# EAGLE schematic RAMBo (EAGLE 6.5.0)
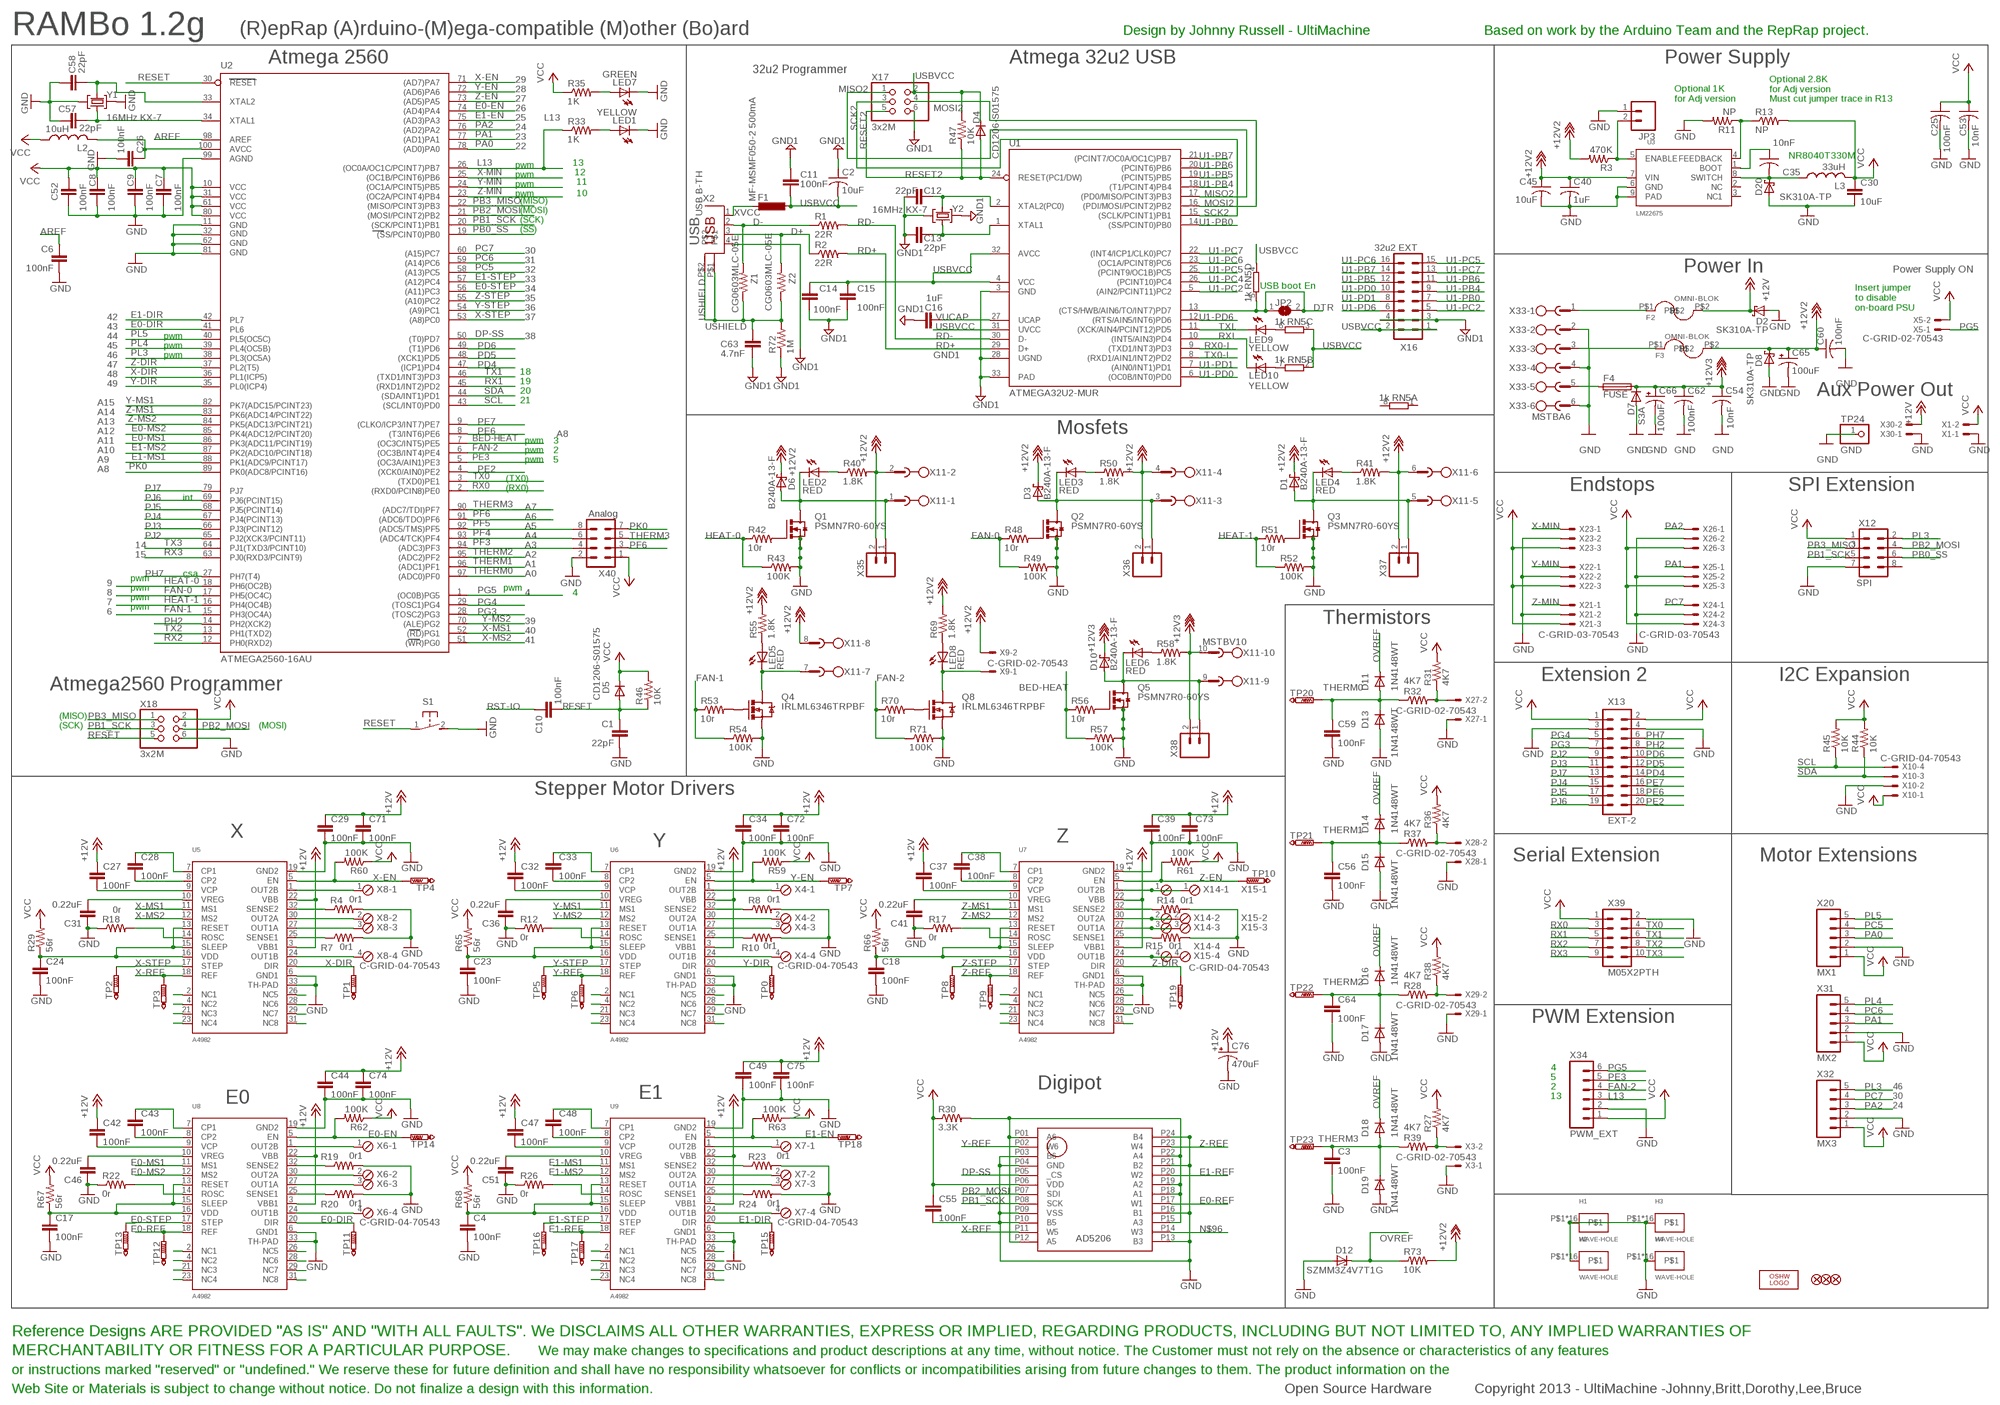
[diagram p0: schematic, sheet 1, part 1 of 2]
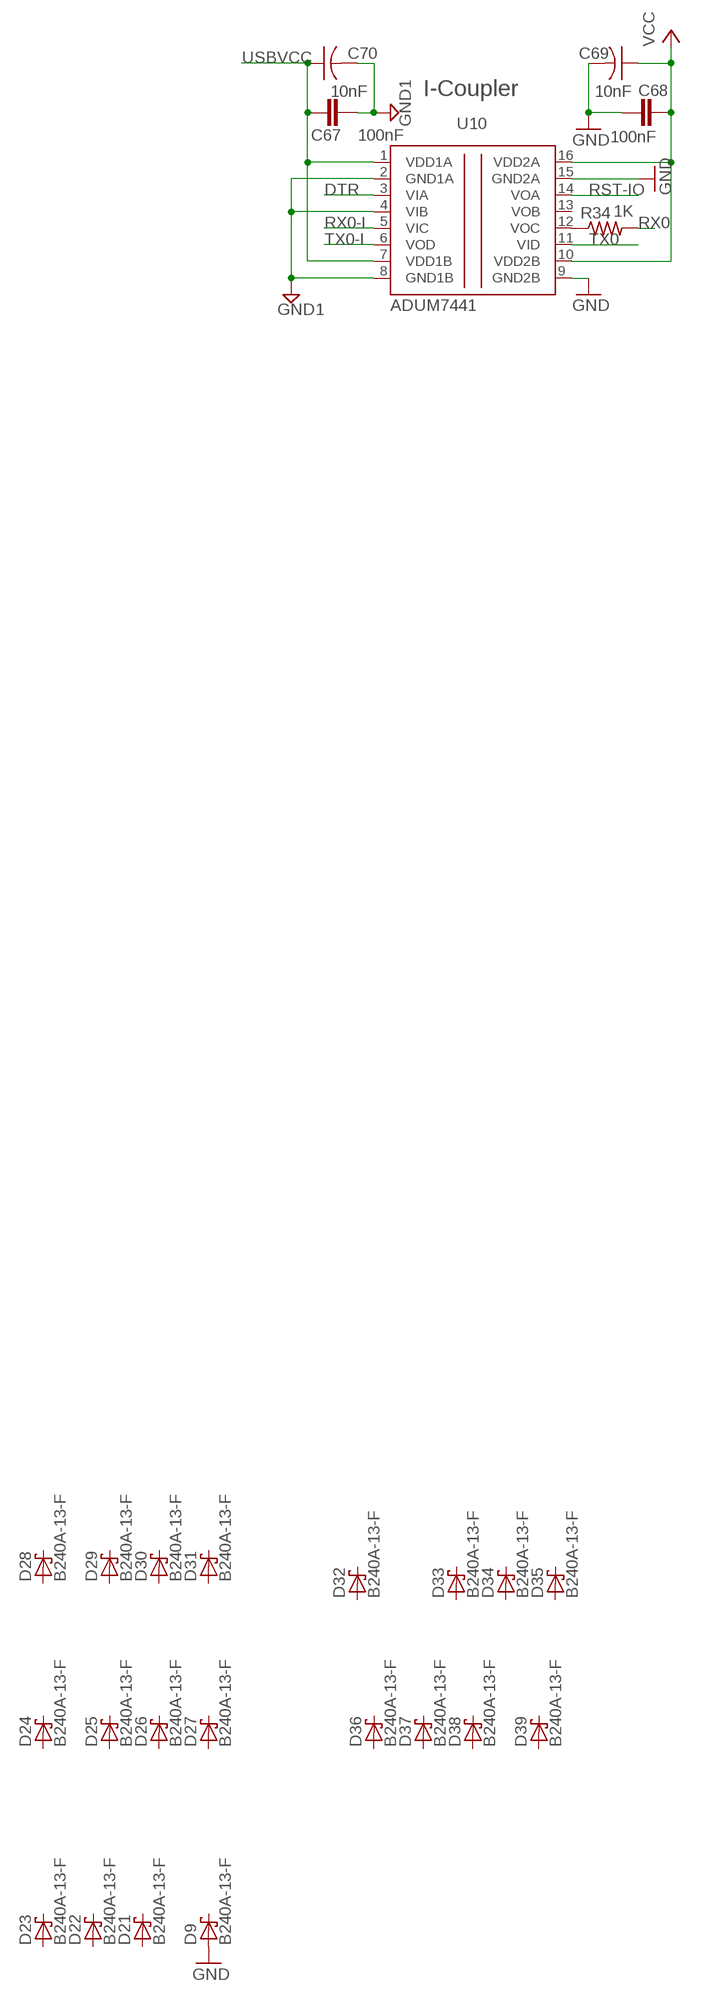
[diagram p1: schematic, sheet 1, part 2 of 2]

## Parts
C1  22pF  C-EUC0603  [C0603]
C2  10uF  C-USC0805  [C0805]
C3  100nF  C-EUC0603  [C0603]
C4  100nF  C-EUC0603  [C0603]
C6  100nF  C-EUC0603  [C0603]
C7  100nF  C-EUC0603  [C0603]
C8  100nF  C-EUC0603  [C0603]
C9  100nF  C-EUC0603  [C0603]
C10  100nF  C-EUC0603  [C0603]
C11  100nF  C-EUC0603  [C0603]
C12  22pF  C-EUC0603  [C0603]
C13  22pF  C-EUC0603  [C0603]
C14  100nF  C-EUC0603  [C0603]
C15  100nF  C-EUC0603  [C0603]
C16  1uF  C-EUC0603  [C0603]
C17  100nF  C-EUC0603  [C0603]
C18  100nF  C-EUC0603  [C0603]
C23  100nF  C-EUC0603  [C0603]
C24  100nF  C-EUC0603  [C0603]
C25  100nF  C-USC0603  [C0603]
C26  100nF  C-EUC0603  [C0603]
C27  100nF  C-EUC0603  [C0603]
C28  100nF  C-EUC0603  [C0603]
C29  100nF  C-EUC0603  [C0603]
C30  10uF  C-EUC1210K  [C1210K]
C31  0.22uF  C-EUC0603  [C0603]
C32  100nF  C-EUC0603  [C0603]
C33  100nF  C-EUC0603  [C0603]
C34  100nF  C-EUC0603  [C0603]
C35  10nF  C-USC0603  [C0603]
C36  0.22uF  C-EUC0603  [C0603]
C37  100nF  C-EUC0603  [C0603]
C38  100nF  C-EUC0603  [C0603]
C39  100nF  C-EUC0603  [C0603]
C40  1uF  C-USC0805  [C0805]
C41  0.22uF  C-EUC0603  [C0603]
C42  100nF  C-EUC0603  [C0603]
C43  100nF  C-EUC0603  [C0603]
C44  100nF  C-EUC0603  [C0603]
C45  10uF  C-USC2220K  [C2220K]
C46  0.22uF  C-EUC0603  [C0603]
C47  100nF  C-EUC0603  [C0603]
C48  100nF  C-EUC0603  [C0603]
C49  100nF  C-EUC0603  [C0603]
C51  0.22uF  C-EUC0603  [C0603]
C52  100nF  C-EUC0603  [C0603]
C53  10nF  C-USC0603  [C0603]
C54  10nF  C-USC0603  [C0603]
C55  100nF  C-EUC0603  [C0603]
C56  100nF  C-EUC0603  [C0603]
C57  22pF  C-EUC0603  [C0603]
C58  22pF  C-EUC0603  [C0603]
C59  100nF  C-EUC0603  [C0603]
C60  100nF  C-USC0603  [C0603]
C62  100nF  C-USC0603  [C0603]
C63  4.7nF  C-EUC0402  [C0402]
C64  100nF  C-EUC0603  [C0603]
C65  100uF  CPOL-USE3.5-8  [E3,5-8]
C66  100uF  CPOL-USE3.5-8  [E3,5-8]
C67  100nF  C-EUC0603  [C0603]
C68  100nF  C-EUC0603  [C0603]
C69  10nF  C-USC0603  [C0603]
C70  10nF  C-USC0603  [C0603]
C71  100nF  C-EUC0603  [C0603]
C72  100nF  C-EUC0603  [C0603]
C73  100nF  C-EUC0603  [C0603]
C74  100nF  C-EUC0603  [C0603]
C75  100nF  C-EUC0603  [C0603]
C76  470uF  CPOL-USC12,5-5  [C12,5-5]
D1  B240A-13-F  SCHOTTKY-DIODE  [SMA-SM]
D2  SK310A-TP  SCHOTTKY-DIODE  [SMA-SM]
D3  B240A-13-F  SCHOTTKY-DIODE  [SMA-SM]
D4  CD1206-S01575  DIODE-MINIMELF  [MINIMELF]
D5  CD1206-S01575  DIODE-MINIMELF  [MINIMELF]
D6  B240A-13-F  SCHOTTKY-DIODE  [SMA-SM]
D7  S3A  DIODE-D0-214AB  [DO-214AB]
D8  SK310A-TP  SCHOTTKY-DIODE  [SMA-SM]
D9  B240A-13-F  SCHOTTKY-DIODE  [SMA-SM]
D10  B240A-13-F  SCHOTTKY-DIODE  [SMA-SM]
D11  1N4148WT  [SOD523]
D12  SZMM3Z4V7T1G  ZENER-DIODESOD323  [SOD323-R]
D13  1N4148WT  [SOD523]
D14  1N4148WT  [SOD523]
D15  1N4148WT  [SOD523]
D16  1N4148WT  [SOD523]
D17  1N4148WT  [SOD523]
D18  1N4148WT  [SOD523]
D19  1N4148WT  [SOD523]
D20  SK310A-TP  SCHOTTKY-DIODE  [SMA-SM]
D21  B240A-13-F  SCHOTTKY-DIODE  [SMA-SM]
D22  B240A-13-F  SCHOTTKY-DIODE  [SMA-SM]
D23  B240A-13-F  SCHOTTKY-DIODE  [SMA-SM]
D24  B240A-13-F  SCHOTTKY-DIODE  [SMA-SM]
D25  B240A-13-F  SCHOTTKY-DIODE  [SMA-SM]
D26  B240A-13-F  SCHOTTKY-DIODE  [SMA-SM]
D27  B240A-13-F  SCHOTTKY-DIODE  [SMA-SM]
D28  B240A-13-F  SCHOTTKY-DIODE  [SMA-SM]
D29  B240A-13-F  SCHOTTKY-DIODE  [SMA-SM]
D30  B240A-13-F  SCHOTTKY-DIODE  [SMA-SM]
D31  B240A-13-F  SCHOTTKY-DIODE  [SMA-SM]
D32  B240A-13-F  SCHOTTKY-DIODE  [SMA-SM]
D33  B240A-13-F  SCHOTTKY-DIODE  [SMA-SM]
D34  B240A-13-F  SCHOTTKY-DIODE  [SMA-SM]
D35  B240A-13-F  SCHOTTKY-DIODE  [SMA-SM]
D36  B240A-13-F  SCHOTTKY-DIODE  [SMA-SM]
D37  B240A-13-F  SCHOTTKY-DIODE  [SMA-SM]
D38  B240A-13-F  SCHOTTKY-DIODE  [SMA-SM]
D39  B240A-13-F  SCHOTTKY-DIODE  [SMA-SM]
F1  MF-MSMF050-2 500mA  L-EUL1812  [L1812]
F2  OMNI-BLOK  [OMNI-BLOK]
F3  OMNI-BLOK  [OMNI-BLOK]
F4  FUSE  [FUSE-ATO-SMD]
FID1  FIDUCIAL1X2  [FIDUCIAL-1X2]
FID2  FIDUCIAL1X2  [FIDUCIAL-1X2]
FID3  FIDUCIAL1X2  [FIDUCIAL-1X2]
H1  WAVE-HOLE  [3,0-WAVE-HOLE]
H2  WAVE-HOLE  [3,0-WAVE-HOLE]
H3  WAVE-HOLE  [3,0-WAVE-HOLE]
H4  WAVE-HOLE  [3,0-WAVE-HOLE]
JP2  SJ  [SJ]
JP3  M02PTH  [1X02]
L2  10uH  L-US  [C0805]
L3  33uH  L-USNR8040  [NR8040]
LED1  YELLOW  LEDCHIP-LED0805  [CHIP-LED0805]
LED2  RED  LEDCHIP-LED0805  [CHIP-LED0805]
LED3  RED  LEDCHIP-LED0805  [CHIP-LED0805]
LED4  RED  LEDCHIP-LED0805  [CHIP-LED0805]
LED5  RED  LEDCHIP-LED0805  [CHIP-LED0805]
LED6  RED  LEDCHIP-LED0805  [CHIP-LED0805]
LED7  GREEN  LEDCHIP-LED0805  [CHIP-LED0805]
LED8  RED  LEDCHIP-LED0805  [CHIP-LED0805]
LED9  YELLOW  LEDCHIP-LED0805  [CHIP-LED0805]
LED10  YELLOW  LEDCHIP-LED0805  [CHIP-LED0805]
LOGO1  OSHW_LOGO_8MILX0150-NT  [OSHW_8X150_NOTEXT]
Q1  PSMN7R0-60YS  PH7030L  [SOT669]
Q2  PSMN7R0-60YS  PH7030L  [SOT669]
Q3  PSMN7R0-60YS  PH7030L  [SOT669]
Q4  IRLML6346TRPBF  MOSFET-NCHANNELSMD  [SOT23-3]
Q5  PSMN7R0-60YS  PH7030L  [SOT669]
Q8  IRLML6346TRPBF  MOSFET-NCHANNELSMD  [SOT23-3]
R1  22R  R-US_R0402  [R0402]
R2  22R  R-US_R0402  [R0402]
R3  470K  R-US_R0603  [R0603]
R4  0r1  R-US_R1206  [R1206]
R7  0r1  R-US_R1206  [R1206]
R8  0r1  R-US_R1206  [R1206]
R10  0r1  R-US_R1206  [R1206]
R11  NP  R-US_R0603  [R0603]
R12  0r  R-US_R0603  [R0603]
R13  NP  R-US_R0603  [R0603]
R14  0r1  R-US_R1206  [R1206]
R15  0r1  R-US_R1206  [R1206]
R17  0r  R-US_R0603  [R0603]
R18  0r  R-US_R0603  [R0603]
R19  0r1  R-US_R1206  [R1206]
R20  0r1  R-US_R1206  [R1206]
R22  0r  R-US_R0603  [R0603]
R23  0r1  R-US_R1206  [R1206]
R24  0r1  R-US_R1206  [R1206]
R26  0r  R-US_R0603  [R0603]
R27  4K7  R-US_R0603  [R0603]
R28  4K7  R-US_R0603  [R0603]
R29  56r  R-US_R0603  [R0603]
R30  3.3K  R-US_R0603  [R0603]
R31  4K7  R-US_R0603  [R0603]
R32  4K7  R-US_R0603  [R0603]
R33  1K  R-US_R0603  [R0603]
R34  1K  R-US_R0603  [R0603]
R35  1K  R-US_R0603  [R0603]
R36  4K7  R-US_R0603  [R0603]
R37  4K7  R-US_R0603  [R0603]
R38  4K7  R-US_R0603  [R0603]
R39  4K7  R-US_R0603  [R0603]
R40  1.8K  R-US_R0603  [R0603]
R41  1.8K  R-US_R0603  [R0603]
R42  10r  R-US_R0603  [R0603]
R43  100K  R-US_R0603  [R0603]
R44  10K  R-US_R0603  [R0603]
R45  10K  R-US_R0603  [R0603]
R46  10K  R-US_R0603  [R0603]
R47  10K  R-US_R0603  [R0603]
R48  10r  R-US_R0603  [R0603]
R49  100K  R-US_R0603  [R0603]
R50  1.8K  R-US_R0603  [R0603]
R51  10r  R-US_R0603  [R0603]
R52  100K  R-US_R0603  [R0603]
R53  10r  R-US_R0603  [R0603]
R54  100K  R-US_R0603  [R0603]
R55  1.8K  R-US_R0603  [R0603]
R56  10r  R-US_R0603  [R0603]
R57  100K  R-US_R0603  [R0603]
R58  1.8K  R-US_R0603  [R0603]
R59  100K  R-US_R0603  [R0603]
R60  100K  R-US_R0603  [R0603]
R61  100K  R-US_R0603  [R0603]
R62  100K  R-US_R0603  [R0603]
R63  100K  R-US_R0603  [R0603]
R65  56r  R-US_R0603  [R0603]
R66  56r  R-US_R0603  [R0603]
R67  56r  R-US_R0603  [R0603]
R68  56r  R-US_R0603  [R0603]
R69  1.8K  R-US_R0603  [R0603]
R70  10r  R-US_R0603  [R0603]
R71  100K  R-US_R0603  [R0603]
R72  1M  R-US_R0402  [R0402]
R73  10K  R-US_R0603  [R0603]
RN5  1k  4R-NCAY16  [CAY16]
S1  31-XX  [B3F-31XX]
TP0  PTR1B1,27TH  [B1,27TH]
TP1  PTR1B1,27TH  [B1,27TH]
TP2  PTR1B1,27TH  [B1,27TH]
TP3  PTR1B1,27TH  [B1,27TH]
TP4  PTR1B1,27TH  [B1,27TH]
TP5  PTR1B1,27TH  [B1,27TH]
TP6  PTR1B1,27TH  [B1,27TH]
TP7  PTR1B1,27TH  [B1,27TH]
TP8  PTR1B1,27TH  [B1,27TH]
TP9  PTR1B1,27TH  [B1,27TH]
TP10  PTR1B1,27TH  [B1,27TH]
TP11  PTR1B1,27TH  [B1,27TH]
TP12  PTR1B1,27TH  [B1,27TH]
TP13  PTR1B1,27TH  [B1,27TH]
TP14  PTR1B1,27TH  [B1,27TH]
TP15  PTR1B1,27TH  [B1,27TH]
TP16  PTR1B1,27TH  [B1,27TH]
TP17  PTR1B1,27TH  [B1,27TH]
TP18  PTR1B1,27TH  [B1,27TH]
TP19  PTR1B1,27TH  [B1,27TH]
TP20  PTR1B1,27  [B1,27]
TP21  PTR1B1,27  [B1,27]
TP22  PTR1B1,27  [B1,27]
TP23  PTR1B1,27  [B1,27]
TP24  GND  PINHD-1X1  [1X01]
U1  ATMEGA32U2-MUR  ATMEGA16U2-MU2  [QFN32TROUND]
U2  ATMEGA2560-16AU  ATMEGA25602560-16AU  [TQFP100]
U3  LM22675  [SOIC127P600X170-9N]
U4  AD5206  [TSSOP24]
U5  A4982  A4982QFN32ROUNDPADS  [QFN32TROUND]
U6  A4982  A4982QFN32ROUNDPADS  [QFN32TROUND]
U7  A4982  A4982QFN32ROUNDPADS  [QFN32TROUND]
U8  A4982  A4982QFN32ROUNDPADS  [QFN32TROUND]
U9  A4982  A4982QFN32ROUNDPADS  [QFN32TROUND]
U10  ADUM7441  [QSOP16]
X1  C-GRID-02-70543  [70543-02]
X2  USB B-TH  PN61729  [PN61729]
X3  C-GRID-02-70543  [70543-02]
X4  C-GRID-04-70543  MPT4  [4POL254]
X5  C-GRID-02-70543  [70543-02]
X6  C-GRID-04-70543  MPT4  [4POL254]
X7  C-GRID-04-70543  MPT4  [4POL254]
X8  C-GRID-04-70543  MPT4  [4POL254]
X9  C-GRID-02-70543  [70543-02]
X10  C-GRID-04-70543  [70543-04]
X11  MSTBV10  [MSTBV10]
X12  SPI  M04X2  [2X4]
X13  EXT-2  M10X2  [2X10]
X14  C-GRID-04-70543  MPT4  [4POL254]
X15  C-GRID-04-70543  MPT4  [4POL254]
X16  32u2 EXT  M08X2  [2X8]
X17  3x2M  PINHD-2X3  [2X03]
X18  3x2M  PINHD-2X3  [2X03]
X20  MX1  M05PTH  [1X05]
X21  C-GRID-03-70543  [70543-03]
X22  C-GRID-03-70543  [70543-03]
X23  C-GRID-03-70543  [70543-03]
X24  C-GRID-03-70543  [70543-03]
X25  C-GRID-03-70543  [70543-03]
X26  C-GRID-03-70543  [70543-03]
X27  C-GRID-02-70543  [70543-02]
X28  C-GRID-02-70543  [70543-02]
X29  C-GRID-02-70543  [70543-02]
X30  C-GRID-02-70543  [70543-02]
X31  MX2  M05PTH  [1X05]
X32  MX3  M05PTH  [1X05]
X33  MSTBA6  [MSTBA6]
X34  PWM_EXT  M06SIP  [1X06]
X35  M02PTH  [1X02]
X36  M02PTH  [1X02]
X37  M02PTH  [1X02]
X38  M02PTH  [1X02]
X39  M05X2PTH  [AVR_ICSP]
X40  Analog  M04X2  [2X4]
Y1  16MHz KX-7  CRYSTAL-3.2-2.5  [CRYSTAL-3.2-2.5]
Y2  16MHz KX-7  CRYSTAL-3.2-2.5  [CRYSTAL-3.2-2.5]
Z1  CG0603MLC-05E  R-US_R0603  [R0603]
Z2  CG0603MLC-05E  R-US_R0603  [R0603]

## Nets
+12V: C27.1 C29.1 C32.1 C34.1 C37.1 C39.1 C42.1 C44.1 C47.1 C49.1 C71.1 C72.1 C73.1 C74.1 C75.1 C76.+ D2.C F2.P$2 U5.3(VBB1) U5.22(VBB) U6.3(VBB1) U6.22(VBB) U7.3(VBB1) U7.22(VBB) U8.3(VBB1) U8.22(VBB) U9.3(VBB1) U9.22(VBB) X30.2
+12V2: C40.1 C45.1 C60.1 C65.+ D1.C D3.C D6.C D8.C F3.P$2 R3.2 R40.2 R41.2 R50.2 R55.2 R69.2 R73.2 U3.7(VIN) X9.2 X11.2 X11.4 X11.6 X11.8 X35.2 X36.2 X37.2
+12V3: C54.1 C62.1 C66.+ D7.C D10.C F4.P$2 R58.2 X11.10 X38.2
AREF: C6.1 U2.98(AREF)
BED-HEAT: R56.1 R57.1 U2.7((OC3C/INT5)PE5)
D+: R2.1 X2.3 Z2.2
D-: R1.1 X2.2 Z1.2
DP-SS: U2.50((T0)PD7) U4.P05(_CS)
DTR: JP2.1 JP2.2 RN5.5 U1.13((CTS/HWB/AIN6/TO/INT7)PD7) U10.3(VIA)
E0-DIR: TP11.TP U2.41(PL6) U8.20(DIR)
E0-EN: R62.2 TP14.TP U2.74((AD4)PA4) U8.5(EN)
E0-MS1: U2.86(PK3(ADC11/PCINT19)) U8.11(MS1)
E0-MS2: U2.85(PK4(ADC12/PCINT20)) U8.12(MS2)
E0-REF: TP12.TP U4.P17(W1) U8.18(REF)
E0-STEP: TP13.TP U2.56((A11)PC3) U8.17(STEP)
E1-DIR: TP15.TP U2.42(PL7) U9.20(DIR)
E1-EN: R63.2 TP18.TP U2.75((AD3)PA3) U9.5(EN)
E1-MS1: U2.88(PK1(ADC9/PCINT17)) U9.11(MS1)
E1-MS2: U2.87(PK2(ADC10/PCINT18)) U9.12(MS2)
E1-REF: TP17.TP U4.P20(W2) U9.18(REF)
E1-STEP: TP16.TP U2.57((A12)PC4) U9.17(STEP)
FAN-0: R48.1 R49.1 U2.17(PH5(OC4C))
FAN-1: R53.1 R54.1 U2.15(PH3(OC4A))
FAN-2: R70.1 R71.1 U2.6((OC3B/INT4)PE4) X34.4
GND [gnd]: C1.2 C3.2 C4.2 C6.2 C7.2 C8.2 C9.2 C17.2 C18.2 C23.2 C24.2 C25.2 C26.2 C29.2 C30.2 C31.1 C34.2 C36.1 C39.2 C40.2 C41.1 C44.2 C45.2 C46.1 C49.2 C51.1 C52.2 C53.2 C54.2 C55.2 C56.2 C57.2 C58.2 C59.2 C60.2 C62.2 C64.2 C65.- C66.- C68.1 C69.2 C71.2 C72.2 C73.2 C74.2 C75.2 C76.- D2.A D7.A D8.A D9.A D12.A D13.A D15.A D17.A D19.A D20.A H1.P$1 H1.P$2 H1.P$3 H1.P$4 H1.P$5 H1.P$6 H1.P$7 H1.P$8 H1.P$17 H1.P$18 H1.P$19 H1.P$20 H1.P$21 H1.P$22 H1.P$23 H1.P$24 H2.P$1 H2.P$2 H2.P$3 H2.P$4 H2.P$5 H2.P$6 H2.P$7 H2.P$8 H2.P$17 H2.P$18 H2.P$19 H2.P$20 H2.P$21 H2.P$22 H2.P$23 H2.P$24 H3.P$1 H3.P$2 H3.P$3 H3.P$4 H3.P$5 H3.P$6 H3.P$7 H3.P$8 H3.P$17 H3.P$18 H3.P$19 H3.P$20 H3.P$21 H3.P$22 H3.P$23 H3.P$24 H4.P$1 H4.P$2 H4.P$3 H4.P$4 H4.P$5 H4.P$6 H4.P$7 H4.P$8 H4.P$17 H4.P$18 H4.P$19 H4.P$20 H4.P$21 H4.P$22 H4.P$23 H4.P$24 JP3.1 LED1.C LED7.C Q1.1(S) Q1.2(S) Q1.3(S) Q2.1(S) Q2.2(S) Q2.3(S) Q3.1(S) Q3.2(S) Q3.3(S) Q4.2(S) Q5.1(S) Q5.2(S) Q5.3(S) Q8.2(S) R4.2 R7.2 R8.2 R10.2 R11.2 R12.1 R14.2 R15.2 R17.1 R18.1 R19.2 R20.2 R22.1 R23.2 R24.2 R26.1 R43.2 R49.2 R52.2 R54.2 R57.2 R71.2 S1.2(S) TP24.1 U2.11(GND) U2.32(GND1) U2.62(GND2) U2.81(GND3) U2.99(AGND) U3.6(GND) U3.9(PAD) U4.P03(B6) U4.P04(GND) U4.P09(VSS) U4.P10(B5) U4.P13(B3) U4.P16(B1) U4.P21(B2) U4.P24(B4) U5.6(GND1) U5.19(GND2) U5.33(TH-PAD) U6.6(GND1) U6.19(GND2) U6.33(TH-PAD) U7.6(GND1) U7.19(GND2) U7.33(TH-PAD) U8.6(GND1) U8.19(GND2) U8.33(TH-PAD) U9.6(GND1) U9.19(GND2) U9.33(TH-PAD) U10.9(GND2B) U10.15(GND2A) X1.1 X3.1 X10.2 X12.7 X13.3 X13.4 X18.6 X20.2 X21.2 X22.2 X23.2 X24.2 X25.2 X26.2 X27.1 X28.1 X29.1 X30.1 X31.2 X32.2 X33.2 X33.4 X33.6 X34.2 X39.2 X40.2 Y1.2(GND) Y1.4(GND)
GND1 [gnd]: C2.1 C11.2 C12.2 C13.2 C14.2 C15.2 C16.2 C63.2 C67.1 C70.2 R72.1 U1.3(GND) U1.28(UGND) U1.33(PAD) U10.2(GND1A) U10.4(VIB) U10.8(GND1B) X2.4 X16.3 X16.4 X17.6 Y2.2(GND) Y2.4(GND)
HEAT-0: R42.1 R43.1 U2.18(PH6(OC2B))
HEAT-1: R51.1 R52.1 U2.16(PH4(OC4B))
L13: R33.1 U2.26((OC0A/OC1C/PCINT7)PB7) X34.3
MISO2: U1.17((PD0/MISO/PCINT3)PB3) X17.1
MOSI2: U1.16((PDI/MOSI/PCINT2)PB2) X17.4
N$1: C31.2 U5.10(VREG)
N$2: LED1.A R33.2
N$3: LED7.A R35.2
N$4: R8.1 U6.32(SENSE2)
N$5: R10.1 U6.25(SENSE1)
N$6: C33.2 U6.8(CP2)
N$7: C32.2 U6.9(VCP)
N$8: C36.2 U6.10(VREG)
N$9: R12.2 U6.14(ROSC)
N$10: Q4.1(G) R53.2
N$11: LED10.A RN5.7
N$12: C24.1 R29.1 U5.13(RESET) U5.15(SLEEP) U5.16(VDD)
N$13: F2.P$1 X33.1
N$14: F3.P$1 X33.3
N$15: JP3.2 R3.1 U3.5(ENABLE)
N$16: F4.P$1 X33.5
N$17: U6.30(OUT2A) X4.2
N$19: U6.27(OUT1A) X4.3
N$20: U6.24(OUT1B) X4.4
N$21: D6.A LED2.C Q1.MB(D) X11.1 X35.1
N$22: R4.1 U5.32(SENSE2)
N$23: U6.1(OUT2B) X4.1
N$24: C33.1 U6.7(CP1)
N$25: C23.1 R65.1 U6.13(RESET) U6.15(SLEEP) U6.16(VDD)
N$26: Q2.4(G) R48.2
N$27: C26.1 L2.2 U2.100(AVCC)
N$28: R14.1 U7.32(SENSE2)
N$29: R15.1 U7.25(SENSE1)
N$30: C38.2 U7.8(CP2)
N$31: C37.2 U7.9(VCP)
N$32: C41.2 U7.10(VREG)
N$33: R17.2 U7.14(ROSC)
N$34: U7.30(OUT2A) X14.2 X15.2
N$35: U7.27(OUT1A) X14.3 X15.3
N$36: R7.1 U5.25(SENSE1)
N$37: C28.2 U5.8(CP2)
N$38: C27.2 U5.9(VCP)
N$40: U7.24(OUT1B) X14.4 X15.4
N$41: U7.1(OUT2B) X14.1 X15.1
N$42: C38.1 U7.7(CP1)
N$43: R18.2 U5.14(ROSC)
N$44: C18.1 R66.1 U7.13(RESET) U7.15(SLEEP) U7.16(VDD)
N$45: LED8.C Q8.3(D) X9.1
N$46: R19.1 U8.32(SENSE2)
N$47: U5.1(OUT2B) X8.1
N$48: C28.1 U5.7(CP1)
N$49: R20.1 U8.25(SENSE1)
N$50: C43.2 U8.8(CP2)
N$51: U5.30(OUT2A) X8.2
N$52: U5.27(OUT1A) X8.3
N$53: U5.24(OUT1B) X8.4
N$54: LED9.A RN5.6
N$55: R34.1 U10.12(VOC)
N$56: C42.2 U8.9(VCP)
N$57: C46.2 U8.10(VREG)
N$58: R22.2 U8.14(ROSC)
N$59: U8.30(OUT2A) X6.2
N$60: U8.27(OUT1A) X6.3
N$61: U8.24(OUT1B) X6.4
N$62: U8.1(OUT2B) X6.1
N$63: C43.1 U8.7(CP1)
N$64: C17.1 R67.1 U8.13(RESET) U8.15(SLEEP) U8.16(VDD)
N$66: R23.1 U9.32(SENSE2)
N$67: R24.1 U9.25(SENSE1)
N$68: C48.2 U9.8(CP2)
N$69: C47.2 U9.9(VCP)
N$70: C51.2 U9.10(VREG)
N$71: R26.2 U9.14(ROSC)
N$72: U9.30(OUT2A) X7.2
N$73: U9.27(OUT1A) X7.3
N$74: U9.24(OUT1B) X7.4
N$75: U9.1(OUT2B) X7.1
N$76: C48.1 U9.7(CP1)
N$77: C4.1 R68.1 U9.13(RESET) U9.15(SLEEP) U9.16(VDD)
N$78: U9.28(NC6)
N$79: LED8.A R69.1
N$80: Q8.1(G) R70.2
N$84: LED2.A R40.1
N$85: U8.28(NC6)
N$86: R30.2 U4.P01(A6) U4.P12(A5) U4.P15(A3) U4.P18(A1) U4.P19(A2) U4.P22(A4)
N$87: R31.1 R32.2 X27.2
N$88: Q1.4(G) R42.2
N$89: R36.1 R37.2 X28.2
N$90: Q3.4(G) R51.2
N$91: R28.2 R38.1 X29.2
N$92: Q5.4(G) R56.2
N$96: U4.P14(W3)
N$98: D3.A LED3.C Q2.MB(D) X11.3 X36.1
N$99: LED3.A R50.1
N$101: D1.A LED4.C Q3.MB(D) X11.5 X37.1
N$102: LED4.A R41.1
N$104: LED5.C Q4.3(D) X11.7
N$105: LED5.A R55.1
N$107: D10.A LED6.C Q5.MB(D) X11.9 X38.1
N$108: LED6.A R58.1
N$120: R27.1 R39.2 X3.2
N$122: U5.2(NC1)
N$123: U5.4(NC2)
N$124: U5.21(NC3)
N$125: U5.23(NC4)
N$126: U5.26(NC5)
N$127: U5.28(NC6)
N$128: U5.29(NC7)
N$129: U5.31(NC8)
N$130: U7.21(NC3)
N$131: C35.1 U3.1(BOOT)
N$132: U6.2(NC1)
N$133: U6.4(NC2)
N$134: U6.21(NC3)
N$135: U6.23(NC4)
N$136: U6.26(NC5)
N$137: U6.28(NC6)
N$138: U6.29(NC7)
N$139: U6.31(NC8)
N$140: U7.2(NC1)
N$141: U7.4(NC2)
N$143: U7.23(NC4)
N$144: U7.26(NC5)
N$145: U7.28(NC6)
N$146: U7.29(NC7)
N$147: U7.31(NC8)
N$148: U8.2(NC1)
N$149: U8.4(NC2)
N$150: U8.21(NC3)
N$151: U8.23(NC4)
N$152: U8.26(NC5)
N$154: U8.29(NC7)
N$155: U8.31(NC8)
N$156: U9.2(NC1)
N$157: U9.4(NC2)
N$158: U9.21(NC3)
N$159: U9.23(NC4)
N$160: U9.26(NC5)
N$162: U9.29(NC7)
N$163: U9.31(NC8)
N$164: R11.1 R13.1 U3.4(FEEDBACK)
N$165: C35.2 D20.C L3.P$1 U3.8(SWITCH)
OVREF: D11.C D12.C D14.C D16.C D18.C R73.1
PA0: U2.78((AD0)PA0) X20.3
PA1: U2.77((AD1)PA1) X25.1 X31.3
PA2: U2.76((AD2)PA2) X26.1 X32.3
PB0_SS: U2.19((SS/PCINT0)PB0) X12.6
PB1_SCK: U2.20((SCK/PCINT1)PB1) U4.P08(SCK) X12.5 X18.3
PB2_MOSI: U2.21((MOSI/PCINT2)PB2) U4.P07(SDI) X12.4 X18.4
PB3_MISO: U2.22((MISO/PCINT3)PB3) X12.3 X18.1
PC5: U2.58((A13)PC5) X20.4
PC6: U2.59((A14)PC6) X31.4
PC7: U2.60((A15)PC7) X24.1 X32.4
PD4: U2.47((ICP1)PD4) X13.14
PD5: U2.48((XCK1)PD5) X13.12
PD6: U2.49((T1)PD6) X13.10
PE2: U2.4((XCK0/AIN0)PE2) X13.20
PE3: U2.5((OC3A/AIN1)PE3) X34.5
PE6: U2.8((T3/INT6)PE6) X13.18
PE7: U2.9((CLKO/ICP3/INT7)PE7) X13.16
PF3: U2.94((ADC3)PF3) X40.4
PF4: U2.93((ADC4/TCK)PF4) X40.6
PF5: U2.92((ADC5/TMS)PF5) X40.8
PF6: U2.91((ADC6/TDO)PF6) X40.3
PG3: U2.28((TOSC2)PG3) X13.7
PG4: U2.29((TOSC1)PG4) X13.5
PG5: U2.1((OC0B)PG5) X5.1 X34.6
PH2: U2.14(PH2(XCK2)) X13.8
PH7: U2.27(PH7(T4)) X13.6
PJ2: U2.65(PJ2(XCK3/PCINT11)) X13.9
PJ3: U2.66(PJ3(PCINT12)) X13.11
PJ4: U2.67(PJ4(PCINT13)) X13.15
PJ5: U2.68(PJ5(PCINT14)) X13.17
PJ6: U2.69(PJ6(PCINT15)) X13.19
PJ7: U2.79(PJ7) X13.13
PK0: U2.89(PK0(ADC8/PCINT16)) X40.7
PL3: U2.38(PL3(OC5A)) X12.2 X32.5
PL4: U2.39(PL4(OC5B)) X31.5
PL5: U2.40(PL5(OC5C)) X20.5
RD+: R2.2 U1.29(D+)
RD-: R1.2 U1.30(D-)
RESET: C1.1 C10.2 D5.A R46.1 S1.1(P) U2.30(RESET) X18.5
RESET2: D4.A R47.1 U1.24(RESET(PC1/DW)) X17.5
RST-IO: C10.1 U10.14(VOA)
RX0: R34.2 U2.2((RXD0/PCIN8)PE0) X39.3
RX0-I: U1.9((TXD1/INT3)PD3) U10.5(VIC)
RX1: U2.45((RXD1/INT2)PD2) X39.5
RX2: U2.12(PH0(RXD2)) X39.7
RX3: U2.63(PJ0(RXD3/PCINT9)) X39.9
RXL: LED10.C U1.10((INT5/AIN3)PD4)
SCK2: U1.15((SCLK/PCINT1)PB1) X17.3
SCL: R45.1 U2.43((SCL/INT0)PD0) X10.4
SDA: R44.1 U2.44((SDA/INT1)PD1) X10.3
THERM0: C59.1 D11.A D13.C R32.1 TP20.TP U2.97((ADC0)PF0)
THERM1: C56.1 D14.A D15.C R37.1 TP21.TP U2.96((ADC1)PF1)
THERM2: C64.1 D16.A D17.C R28.1 TP22.TP U2.95((ADC2)PF2)
THERM3: C3.1 D18.A D19.C R39.1 TP23.TP U2.90((ADC7/TDI)PF7) X40.5
TX0: U2.3((TXD0)PE1) U10.11(VID) X39.4
TX0-I: U1.8((RXD1/AIN1/INT2)PD2) U10.6(VOD)
TX1: U2.46((TXD1/INT3)PD3) X39.6
TX2: U2.13(PH1(TXD2)) X39.8
TX3: U2.64(PJ1(TXD3/PCINT10)) X39.10
TXL: LED9.C U1.11((XCK/AIN4/PCINT12)PD5)
U1-PB0: U1.14((SS/PCINT0)PB0) X16.7
U1-PB4: U1.18((T1/PCINT4)PB4) X16.9
U1-PB5: U1.19((PCINT5)PB5) X16.12
U1-PB6: U1.20((PCINT6)PB6) X16.11
U1-PB7: U1.21((PCINT7/OC0A/OC1C)PB7) X16.14
U1-PC2: U1.5((AIN2/PCINT11)PC2) X16.5
U1-PC4: U1.26((PCINT10)PC4)
U1-PC5: U1.25((PCINT9/OC1B)PC5) X16.15
U1-PC6: U1.23((OC1A/PCINT8)PC6) X16.16
U1-PC7: U1.22((INT4/ICP1/CLK0)PC7) X16.13
U1-PD0: U1.6((OC0B/INT0)PD0) X16.10
U1-PD1: U1.7((AIN0/INT1)PD1) X16.8
U1-PD6: U1.12((RTS/AIN5/INT6)PD6) X16.6
USBVCC [power usb]: C2.2 C11.1 C14.1 C15.1 C67.2 C70.1 D4.C F1.1 R47.2 RN5.2 RN5.3 RN5.4 U1.4(VCC) U1.31(UVCC) U1.32(AVCC) U10.1(VDD1A) U10.7(VDD1B) X16.1 X16.2 X17.2
USHIELD [gnd]: C63.1 R72.2 X2.P$1 X2.P$2 Z1.1 Z2.1
VCC: C7.1 C8.1 C9.1 C25.1 C30.1 C52.1 C53.1 C55.1 C68.2 C69.1 D5.C L2.1 L3.P$2 R13.2 R27.2 R29.2 R30.1 R31.2 R35.1 R36.2 R38.2 R44.2 R45.2 R46.2 R59.1 R60.1 R61.1 R62.1 R63.1 R65.2 R66.2 R67.2 R68.2 U2.10(VCC) U2.31(VCC1) U2.61(VCC2) U2.80(VCC3) U4.P06(VDD) U10.10(VDD2B) U10.16(VDD2A) X1.2 X5.2 X10.1 X12.1 X13.1 X13.2 X18.2 X20.1 X21.3 X22.3 X23.3 X24.3 X25.3 X26.3 X31.1 X32.1 X34.1 X39.1 X40.1
VUCAP: C16.1 U1.27(UCAP)
X-DIR: TP1.TP U2.36(PL1(ICP5)) U5.20(DIR)
X-EN: R60.2 TP4.TP U2.71((AD7)PA7) U5.5(EN)
X-MIN: U2.25((OC1B/PCINT6)PB6) X23.1
X-MS1: U2.52((RD)PG1) U5.11(MS1)
X-MS2: U2.51((WR)PG0) U5.12(MS2)
X-REF: TP3.TP U4.P11(W5) U5.18(REF)
X-STEP: TP2.TP U2.53((A8)PC0) U5.17(STEP)
XT1: C13.1 U1.1(XTAL1) Y2.1(C1)
XT2: C12.1 U1.2(XTAL2(PC0)) Y2.3(C2)
XTAL1: C57.1 U2.34(XTAL1) Y1.1(C1)
XTAL2: C58.1 U2.33(XTAL2) Y1.3(C2)
XVCC [power usb]: F1.2 X2.1
Y-DIR: TP0.TP U2.35(PL0(ICP4)) U6.20(DIR)
Y-EN: R59.2 TP7.TP U2.72((AD6)PA6) U6.5(EN)
Y-MIN: U2.24((OC1A/PCINT5)PB5) X22.1
Y-MS1: U2.82(PK7(ADC15/PCINT23)) U6.11(MS1)
Y-MS2: U2.70((ALE)PG2) U6.12(MS2)
Y-REF: TP6.TP U4.P02(W6) U6.18(REF)
Y-STEP: TP5.TP U2.54((A9)PC1) U6.17(STEP)
Z-DIR: TP19.TP U2.37(PL2(T5)) U7.20(DIR)
Z-EN: R61.2 TP10.TP U2.73((AD5)PA5) U7.5(EN)
Z-MIN: U2.23((OC2A/PCINT4)PB4) X21.1
Z-MS1: U2.83(PK6(ADC14/PCINT22)) U7.11(MS1)
Z-MS2: U2.84(PK5(ADC13/PCINT21)) U7.12(MS2)
Z-REF: TP9.TP U4.P23(W4) U7.18(REF)
Z-STEP: TP8.TP U2.55((A10)PC2) U7.17(STEP)
Unconnected: D9.C D21.A D21.C D22.A D22.C D23.A D23.C D24.A D24.C D25.A D25.C D26.A D26.C D27.A D27.C D28.A D28.C D29.A D29.C D30.A D30.C D31.A D31.C D32.A D32.C D33.A D33.C D34.A D34.C D35.A D35.C D36.A D36.C D37.A D37.C D38.A D38.C D39.A D39.C RN5.1 RN5.8 U3.2(NC) U3.3(NC1) U10.13(VOB) X12.8

## Notes on the sheet
- RAMBo 1.2g | (R)epRap (A)rduino-(M)ega-compatible (M)other (Bo)ard | Design by Johnny Russell - UltiMachine | Based on work by the Arduino Team and the RepRap project.
- Atmega 2560 | Atmega 32u2 USB | Power Supply
- 32u2 Programmer
- 29
- 28
- Optional 2.8K 
  for Adj version
- 27
- Optional 1K 
  for Adj version
- Must cut jumper trace in R13
- 26
- 25
- 24
- 23
- 22
- NR8040T330M
- pwm | 13 | I-Coupler
- pwm | 12
- pwm | 11
- pwm | 10
- (MISO)
- (MOSI)
- (SCK)
- (SS)
- USB
- 30
- 31
- 32 | Power In | Power Supply ON
- 33
- USB boot En
- 34
- 35
- 36
- Insert jumper
  to disable
  on-board PSU
- 42 | 37
- 43
- 44 | pwm | 38
- 45 | pwm
- 46 | pwm
- 47
- 48 | 18
- 49 | 19
- 20 | Aux Power Out
- A15 | 21
- A14
- A13
- A12 | Mosfets
- A8
- A11 | pwm | 3
- A10 | pwm | 2
- A9 | pwm | 5
- A8
- (TX0)
- (RX0) | Endstops | SPI Extension
- int
- A7
- A6
- A5
- A4
- 14 | A3
- 15 | A2
- A1
- csa | A0
- pwm
- 9
- pwm | pwm
- 8 | 4 | 4
- pwm
- 7
- pwm
- 6
- 39 | Thermistors
- 40
- 41
- Extension 2 | I2C Expansion
- Atmega2560 Programmer
- (MISO)
- (SCK) | (MOSI)
- Stepper Motor Drivers
- X | Z
- Y
- Serial Extension | Motor Extensions
- PWM Extension
- 4
- 5
- Digipot | 2 | 46
- E0 | E1 | 13 | 30
- 24
- AD5206
- Reference Designs ARE PROVIDED "AS IS" AND "WITH ALL FAULTS". We DISCLAIMS ALL OTHER WARRANTIES, EXPRESS OR IMPLIED, REGARDING PRODUCTS, INCLUDING BUT NOT LIMITED TO, ANY IMPLIED WARRANTIES OF
- MERCHANTABILITY OR FITNESS FOR A PARTICULAR PURPOSE. | We may make changes to specifications and product descriptions at any time, without notice. The Customer must not rely on the absence or characteristics of any features
- or instructions marked "reserved" or "undefined." We reserve these for future definition and shall have no responsibility whatsoever for conflicts or incompatibilities arising from future changes to them. The product information on the
- Web Site or Materials is subject to change without notice. Do not finalize a design with this information. | Open Source Hardware | Copyright 2013 - UltiMachine -Johnny,Britt,Dorothy,Lee,Bruce

## Library data of the parts
C1 C3 C4 C6-C18 C23 C24 C26-C34 C36-C39 C41-C44 C46-C49 C51 C52 C55-C59 C64 C67 C68 C71-C75 = resistor:C-EU: CAPACITOR, European symbol
C2 C25 C35 C40 C45 C53 C54 C60 C62 C69 C70 = rcl:C-US: CAPACITOR, American symbol
C63 = rcl:C-EU: CAPACITOR, European symbol
C65 C66 C76 = resistor:CPOL-US: POLARIZED CAPACITOR, American symbol
D1-D3 D6 D8-D10 D20-D39 = ultimachine1:SCHOTTKY-DIODE: Schottky Diode
D4 D5 = diode:DIODE-: DIODE
D7 = ultimachine:DIODE-: DIODE
D11 D13-D19 = diode:1N4148: DIODE high speed (Philips)
D12 = diode:ZENER-DIODE: Z-Diode
F1 = rcl:L-EU: INDUCTOR, European symbol
F2 F3 = ultimachine1:OMNI-BLOK
F4 = RepRapjr (3):FUSE
FID1-FID3 = SparkFun:FIDUCIAL: Fiducial Alignment Points Various fiducial points for machine vision alignment.
H1-H4 = ultimachine:WAVE-HOLE
JP2 = jumper:SJ: SMD solder JUMPER
JP3 X35-X38 = SparkFun:M02: Header 2 Standard 2-pin 0.1" header. Use with straight break away headers (SKU : PRT-00116), right angle break away headers (PRT-00553), swiss pins (PRT-00743), machine pins (PRT-00117), and female headers (PRT-00115). Molex polarized connector foot print use with SKU : PRT-08233 with associated crimp pins and housings.
L2 = resistor:L-US: INDUCTOR, American symbol
L3 = ultimachine:L-US: INDUCTOR, American symbol
LED1-LED10 = led:LED: LED OSRAM: - CHIPLED LG R971, LG N971, LY N971, LG Q971, LY Q971, LO R971, LY R971 LH N974, LH R974 LS Q976, LO Q976, LY Q976 LO Q996 - Hyper CHIPLED LW Q18S LB Q993, LB Q99A, LB R99A - SideLED LS A670, LO A670, LY A670, LG A670, LP A670 LB A673, LV A673, LT A673, LW A673 LH A674 LY A675 LS A676, LA A676, LO A676, LY A676, LW A676 LS A679, LY A679, LG A679 - Hyper Micro SIDELED® LS Y876, LA Y876, LO Y876, LY Y876 LT Y87S - SmartLED LW L88C, LW L88S LB L89C, LB L89S, LG L890 LS L89K, LO L89K, LY L89K LS L896, LA L896, LO L896, LY L896 - TOPLED LS T670, LO T670, LY T670, LG T670, LP T670 LSG T670, LSP T670, LSY T670, LOP T670, LYG T670 LG T671, LOG T671, LSG T671 LB T673, LV T673, LT T673, LW T673 LH T674 LS T676, LA T676, LO T676, LY T676, LB T676, LH T676, LSB T676, LW T676 LB T67C, LV T67C, LT T67C, LS T67K, LO T67K, LY T67K, LW E67C LS E67B, LA E67B, LO E67B, LY E67B, LB E67C, LV E67C, LT E67C LW T67C LS T679, LY T679, LG T679 LS T770, LO T770, LY T770, LG T770, LP T770 LB T773, LV T773, LT T773, LW T773 LH T774 LS E675, LA E675, LY E675, LS T675 LS T776, LA T776, LO T776, LY T776, LB T776 LHGB T686 LT T68C, LB T68C - Hyper Mini TOPLED® LB M676 - Mini TOPLED Santana® LG M470 LS M47K, LO M47K, LY M47K Source: http://www.osram.convergy.de LUXEON: - LUMILED® LXK2-PW12-R00, LXK2-PW12-S00, LXK2-PW14-U00, LXK2-PW14-V00 LXK2-PM12-R00, LXK2-PM12-S00, LXK2-PM14-U00 LXK2-PE12-Q00, LXK2-PE12-R00, LXK2-PE12-S00, LXK2-PE14-T00, LXK2-PE14-U00 LXK2-PB12-K00, LXK2-PB12-L00, LXK2-PB12-M00, LXK2-PB14-N00, LXK2-PB14-P00, LXK2-PB14-Q00 LXK2-PR12-L00, LXK2-PR12-M00, LXK2-PR14-Q00, LXK2-PR14-R00 LXK2-PD12-Q00, LXK2-PD12-R00, LXK2-PD12-S00 LXK2-PH12-R00, LXK2-PH12-S00 LXK2-PL12-P00, LXK2-PL12-Q00, LXK2-PL12-R00 Source: www.luxeon.com KINGBRIGHT: KA-3528ASYC Source: www.kingbright.com
LOGO1 = ohw-logo:OSHW_LOGO_8MIL
Q1-Q3 Q5 = transistor-power:PH7030L: N-channel TrenchMOS (TM) logic level FET Source: http://www.nxp.com/acrobat_download/datasheets/PH7030L_4.pdf
Q4 Q8 = SparkFun:MOSFET-NCHANNEL
R1 R2 R72 = rcl:R-US_: RESISTOR, American symbol
R3 R4 R7 R8 R10-R15 R17-R20 R22-R24 R26-R63 R65-R71 R73 Z1 Z2 = resistor:R-US_: RESISTOR, American symbol
RN5 = resistor-dil:4R-N: Array Chip Resistor Source: RS Component / Phycomp; OC_FARNELL: unknown; OC_NEWARK: unknown
S1 = adafruit:31-XX: OMRON SWITCH Now with beefier pads!
TP0 TP1-TP23 = testpad:PTR1: TEST PIN
TP24 = adafruit:PINHD-1X1: Pin header 1x1 for 0.1" spacing With round pins
U1 = ultimachine:ATMEGA16U2-
U2 = SmartPrj:ATMEGA2560: MICROCONTROLLER 64/128/256 Kbytes FLASH 4 Kbytes EEPROM 8 Kbytes SRAM 86 General Purpose I/O pins 12-channels16-bit PWM 4 x Serial USARTs 16-channels 10-bit A/D
U3 = ultimachine:LM22675
U4 = untitled:AD5206
U5-U9 = ultimachine:A4982QFN32
U10 = ultimachine:ADUM7441
X1 X3 X5 X9 X27-X30 = con-molex:C-GRID-02: CONNECTOR wire to board 2.54 mm (0.100") pitch header; OC_FARNELL: unknown; OC_NEWARK: unknown
X2 = SmartPrj:PN61729: BERG USB connector
X4 X6-X8 X14 X15 = con-phoenix-254:MPT4: PHOENIX CONNECTOR; OC_FARNELL: unknown; OC_NEWARK: unknown
X10 = con-molex:C-GRID-04: CONNECTOR wire to board 2.54 mm (0.100") pitch header; OC_FARNELL: unknown; OC_NEWARK: unknown
X11 = con-phoenix-508:MSTBV10: PHOENIX; MPN: MSTBV 2,5/10-GF-5.08; OC_FARNELL: 1792798; OC_NEWARK: 69R9844
X12 X40 = SparkFun:M04X2
X13 = SparkFun:M10X2: This was SPECIALLY designed to be used with our Graphic LCD Backpack. Be sure you want to use this! It is not only staggered on each line of header holes, but IT IS ALSO offset of the center point of the top and bottom lines by 5 mil. This causes the headers to lock into place on the "standard" footprint on the LCD screen. The extra squares on the tdocu layer are there simply to reference other pins (if you were to actually populate a longer header than ten long - this is what we do with the backpacks).
X16 = SparkFun:M08X2
X17 X18 = SmartPrj:PINHD-2X3: PIN HEADER
X20 X31 X32 = SparkFun:M05: Header 5 Standard 5-pin 0.1" header. Use with straight break away headers (SKU : PRT-00116), right angle break away headers (PRT-00553), swiss pins (PRT-00743), machine pins (PRT-00117), and female headers (PRT-00115). Molex polarized connector foot print use with SKU : PRT-08230 with associated crimp pins and housings.
X21-X26 = con-molex:C-GRID-03: CONNECTOR wire to board 2.54 mm (0.100") pitch header; OC_FARNELL: unknown; OC_NEWARK: unknown
X33 = con-phoenix-508:MSTBA6: PHOENIX; MF: FARNELL; MPN: 1757284; OC_FARNELL: 3705213; OC_NEWARK: 71C4165
X34 = SparkFun:M06: Header 6 Standard 6-pin 0.1" header. Use with straight break away headers (SKU : PRT-00116), right angle break away headers (PRT-00553), swiss pins (PRT-00743), machine pins (PRT-00117), and female headers (PRT-00115). Molex polarized connector foot print use with SKU : PRT-08094 with associated crimp pins and housings. NOTES ON THE VARIANTS LOCK and LOCK_LONGPADS... This footprint was designed to help hold the alignment of a through-hole component (i.e. 6-pin header) while soldering it into place. You may notice that each hole has been shifted either up or down by 0.005 of an inch from it's more standard position (which is a perfectly straight line). This slight alteration caused the pins (the squares in the middle) to touch the edges of the holes. Because they are alternating, it causes a "brace" to hold the component in place. 0.005 has proven to be the perfect amount of "off-center" position when using our standard breakaway headers. Although looks a little odd when you look at the bare footprint, once you have a header in there, the alteration is very hard to notice. Also, if you push a header all the way into place, it is covered up entirely on the bottom side. This idea of altering the position of holes to aid alignment will be further integrated into the Sparkfun Library for other footprints. It can help hold any component with 3 or more connection pins.
X39 = SparkFun:M05X2: Header 5x2 Standard 10-pin dual row 0.1" header. Commonly used with AVR-ISP. Use with Spark Fun Electronics SKU: PRT-00778
Y1 Y2 = SmartPrj:CRYSTAL-3.2-2.5

## Net classes
0 default: width 0.178 mm, drill 0.381 mm, clearance 0.178 mm
1 power: width 0.203 mm, drill 0.381 mm, clearance 0.178 mm
2 gnd: width 0.203 mm, drill 0.381 mm, clearance 0.178 mm
3 power usb: width 0.203 mm, drill 0.381 mm, clearance 0.178 mm